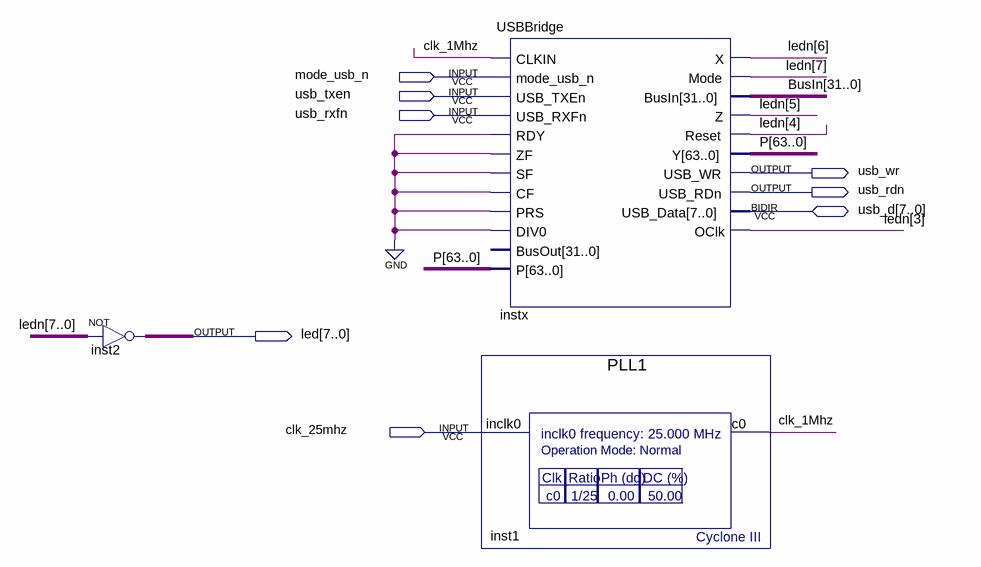
[diagram p0: schematic sheet]
// Quartus schematic Lab1.bdf as structural Verilog: 3 symbols, 8 pins
module Lab1 (
  input  mode_usb_n,
  input  usb_txen,
  input  usb_rxfn,
  input  clk_25mhz,
  inout  [7:0] usb_d,
  output usb_wr,
  output usb_rdn,
  output [7:0] led
);

  wire clk_1Mhz;
  wire [7:0] ledn;
  wire [31:0] BusIn;
  wire [63:0] P;

  assign led = ~ledn;  // NOT inst2, 8 bits wide
  USBBridge instx (
    .CLKIN(clk_1Mhz), .mode_usb_n(mode_usb_n), .USB_TXEn(usb_txen), .USB_RXFn(usb_rxfn), .RDY(1'b0),
    .ZF(1'b0), .SF(1'b0), .CF(1'b0), .PRS(1'b0), .DIV0(1'b0), .P(P), .X(ledn[6]), .Mode(ledn[7]),
    .BusIn(BusIn), .Z(ledn[5]), .Reset(ledn[4]), .Y(P), .USB_WR(usb_wr), .USB_RDn(usb_rdn), .OClk(ledn[3]),
    .USB_Data(usb_d));  // open: BusOut
  PLL1 inst1 (.inclk0(clk_25mhz), .c0(clk_1Mhz));
endmodule
